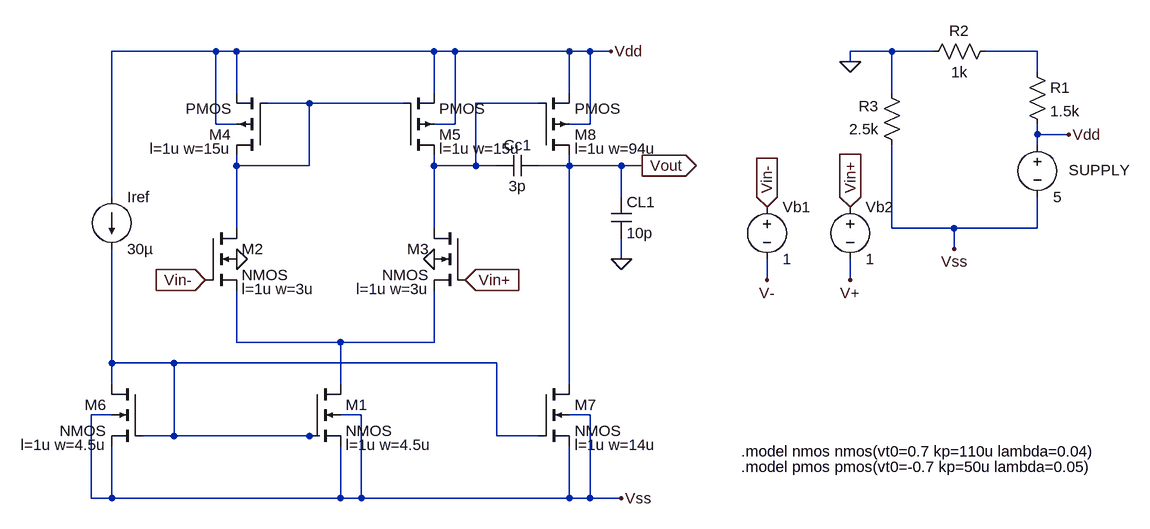
[diagram p0: schematic error_amplifier.asc]
error_amplifier.asc, the LTspice schematic file:
Version 4
SHEET 1 1520 680
WIRE 112 -160 -48 -160
WIRE 144 -160 112 -160
WIRE 448 -160 144 -160
WIRE 480 -160 448 -160
WIRE 656 -160 480 -160
WIRE 688 -160 656 -160
WIRE 720 -160 688 -160
WIRE 1152 -160 1088 -160
WIRE 1216 -160 1152 -160
WIRE 1376 -160 1296 -160
WIRE 1088 -144 1088 -160
WIRE 1376 -128 1376 -160
WIRE 144 -96 144 -160
WIRE 448 -96 448 -160
WIRE 656 -96 656 -160
WIRE 1152 -96 1152 -160
WIRE 256 -80 192 -80
WIRE 400 -80 256 -80
WIRE 608 -80 512 -80
WIRE 112 -48 112 -160
WIRE 144 -48 112 -48
WIRE 480 -48 480 -160
WIRE 480 -48 448 -48
WIRE 688 -48 688 -160
WIRE 688 -48 656 -48
WIRE 1376 -32 1376 -48
WIRE 1424 -32 1376 -32
WIRE 1376 -16 1376 -32
WIRE 144 16 144 0
WIRE 256 16 256 -80
WIRE 256 16 144 16
WIRE 448 16 448 0
WIRE 512 16 512 -80
WIRE 512 16 448 16
WIRE 544 16 512 16
WIRE 656 16 656 0
WIRE 656 16 608 16
WIRE 736 16 656 16
WIRE 768 16 736 16
WIRE -48 64 -48 -160
WIRE 736 64 736 16
WIRE 144 112 144 16
WIRE 448 112 448 16
WIRE 1152 112 1152 -16
WIRE 1248 112 1152 112
WIRE 1376 112 1376 64
WIRE 1376 112 1248 112
WIRE 1248 144 1248 112
WIRE 736 160 736 128
WIRE 960 192 960 160
WIRE 1088 192 1088 160
WIRE 144 288 144 208
WIRE 304 288 144 288
WIRE 448 288 448 208
WIRE 448 288 304 288
WIRE -48 320 -48 144
WIRE 48 320 -48 320
WIRE 544 320 48 320
WIRE -48 352 -48 320
WIRE 304 352 304 288
WIRE 656 352 656 16
WIRE -48 400 -80 400
WIRE 336 400 304 400
WIRE 688 400 656 400
WIRE 48 432 48 320
WIRE 48 432 0 432
WIRE 256 432 48 432
WIRE 272 432 256 432
WIRE 544 432 544 320
WIRE 608 432 544 432
WIRE -80 528 -80 400
WIRE -48 528 -48 448
WIRE -48 528 -80 528
WIRE 304 528 304 448
WIRE 304 528 -48 528
WIRE 336 528 336 400
WIRE 336 528 304 528
WIRE 656 528 656 448
WIRE 656 528 336 528
WIRE 688 528 688 400
WIRE 688 528 656 528
WIRE 736 528 688 528
FLAG 144 160 0
FLAG 448 160 0
FLAG 736 160 0
FLAG 720 -160 Vdd
FLAG 736 528 Vss
FLAG 96 192 Vin-
IOPIN 96 192 In
FLAG 496 192 Vin+
IOPIN 496 192 In
FLAG 960 80 Vin-
IOPIN 960 80 In
FLAG 1088 80 Vin+
IOPIN 1088 80 In
FLAG 768 16 Vout
IOPIN 768 16 Out
FLAG 1088 192 V+
FLAG 960 192 V-
FLAG 1088 -144 0
FLAG 1424 -32 Vdd
FLAG 1248 144 Vss
SYMBOL nmos4 256 352 R0
WINDOW 123 56 94 Left 2
SYMATTR Value2 l=1u w=4.5u
SYMATTR InstName M1
SYMBOL nmos4 96 112 R0
WINDOW 123 56 94 Left 2
SYMATTR Value2 l=1u w=3u
SYMATTR InstName M2
SYMBOL nmos4 496 112 M0
WINDOW 123 56 94 Left 2
SYMATTR Value2 l=1u w=3u
SYMATTR InstName M3
SYMBOL pmos4 192 0 R180
WINDOW 123 56 10 Left 2
SYMATTR Value2 l=1u w=15u
SYMATTR InstName M4
SYMBOL pmos4 400 0 M180
WINDOW 123 56 10 Left 2
SYMATTR Value2 l=1u w=15u
SYMATTR InstName M5
SYMBOL nmos4 0 352 M0
WINDOW 123 56 94 Left 2
SYMATTR Value2 l=1u w=4.5u
SYMATTR InstName M6
SYMBOL current -48 64 R0
SYMATTR InstName Iref
SYMATTR Value 30µ
SYMBOL nmos4 608 352 R0
WINDOW 123 56 94 Left 2
SYMATTR Value2 l=1u w=14u
SYMATTR InstName M7
SYMBOL pmos4 608 0 M180
WINDOW 123 56 10 Left 2
SYMATTR Value2 l=1u w=94u
SYMATTR InstName M8
SYMBOL cap 608 0 R90
WINDOW 0 0 32 VBottom 2
WINDOW 3 32 32 VTop 2
SYMATTR InstName Cc1
SYMATTR Value 3p
SYMBOL cap 720 64 R0
SYMATTR InstName CL1
SYMATTR Value 10p
SYMBOL voltage 960 64 R0
SYMATTR InstName Vb1
SYMATTR Value 1
SYMBOL voltage 1088 64 R0
WINDOW 123 0 0 Left 0
WINDOW 39 0 0 Left 0
SYMATTR InstName Vb2
SYMATTR Value 1
SYMBOL voltage 1376 -32 R0
WINDOW 0 48 55 Left 2
SYMATTR InstName SUPPLY
SYMATTR Value 5
SYMBOL res 1360 -144 R0
SYMATTR InstName R1
SYMATTR Value 1.5k
SYMBOL res 1200 -144 R270
WINDOW 0 32 56 VTop 2
WINDOW 3 0 56 VBottom 2
SYMATTR InstName R2
SYMATTR Value 1k
SYMBOL res 1168 0 R180
WINDOW 0 36 76 Left 2
WINDOW 3 36 40 Left 2
SYMATTR InstName R3
SYMATTR Value 2.5k
TEXT 920 456 Left 2 !.model nmos nmos(vt0=0.7 kp=110u lambda=0.04)
TEXT 920 480 Left 2 !.model pmos pmos(vt0=-0.7 kp=50u lambda=0.05)

The netlist it stands for:
* error_amplifier.asc
M1 N004 N005 Vss Vss NMOS l=1u w=4.5u
M2 N002 Vin- N004 0 NMOS l=1u w=3u
M3 N003 Vin+ N004 0 NMOS l=1u w=3u
M4 N002 N002 Vdd Vdd PMOS l=1u w=15u
M5 N003 N002 Vdd Vdd PMOS l=1u w=15u
M6 N005 N005 Vss Vss NMOS l=1u w=4.5u
Iref Vdd N005 30µ
M7 Vout N005 Vss Vss NMOS l=1u w=14u
M8 Vout N003 Vdd Vdd PMOS l=1u w=94u
Cc1 Vout N003 3p
CL1 Vout 0 10p
Vb1 Vin- V- 1
Vb2 Vin+ V+ 1
V§SUPPLY Vdd Vss 5
R1 N001 Vdd 1.5k
R2 0 N001 1k
R3 Vss 0 2.5k
.model NMOS NMOS
.model PMOS PMOS
.lib standard.mos
.model nmos nmos(vt0=0.7 kp=110u lambda=0.04)
.model pmos pmos(vt0=-0.7 kp=50u lambda=0.05)
.backanno
.end